# EasyEDA schematic SCH_μAtlas_2026-06-27.json

## Sheets
1 PWR_Management: TITLE: PWR Management; REV: 1.0; Date: 2026-06-20; Sheet: 1/8; Drawn By: httperry; Company: HackClub - Macondo
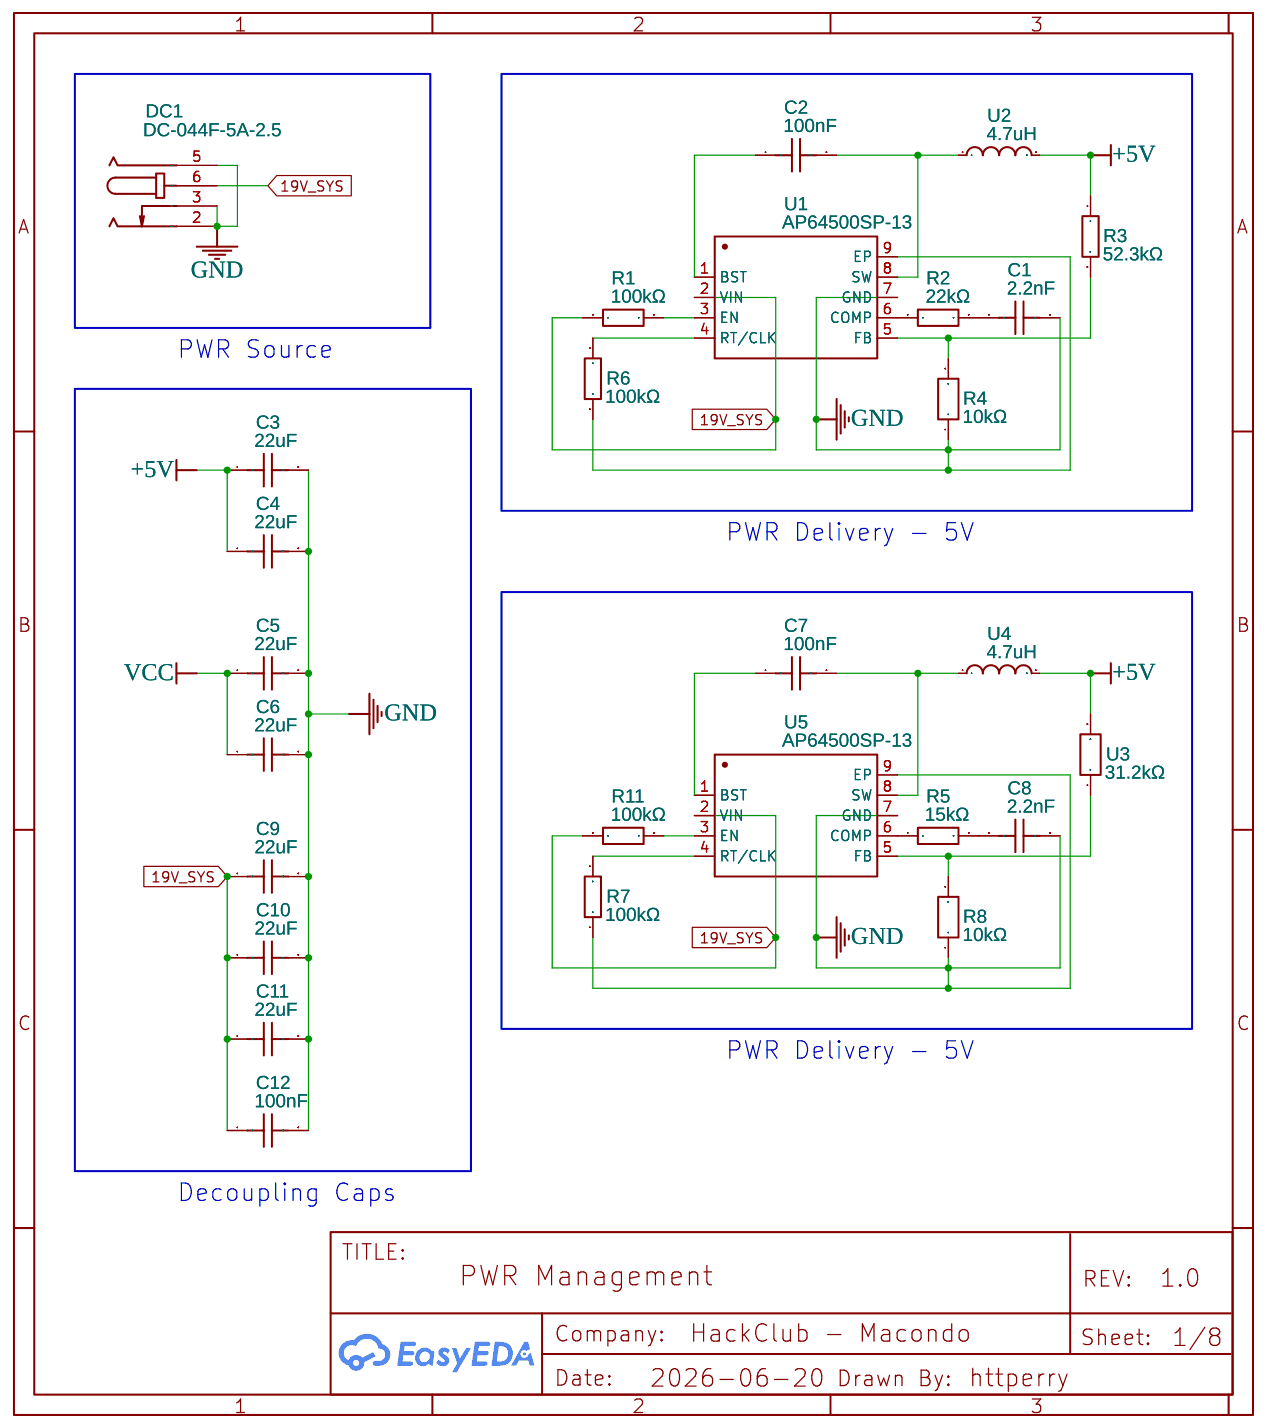
[diagram p0: PWR_Management]
2 SATA_Ports: TITLE: SATA Ports; Date: 2026-06-21; Sheet: 2/8
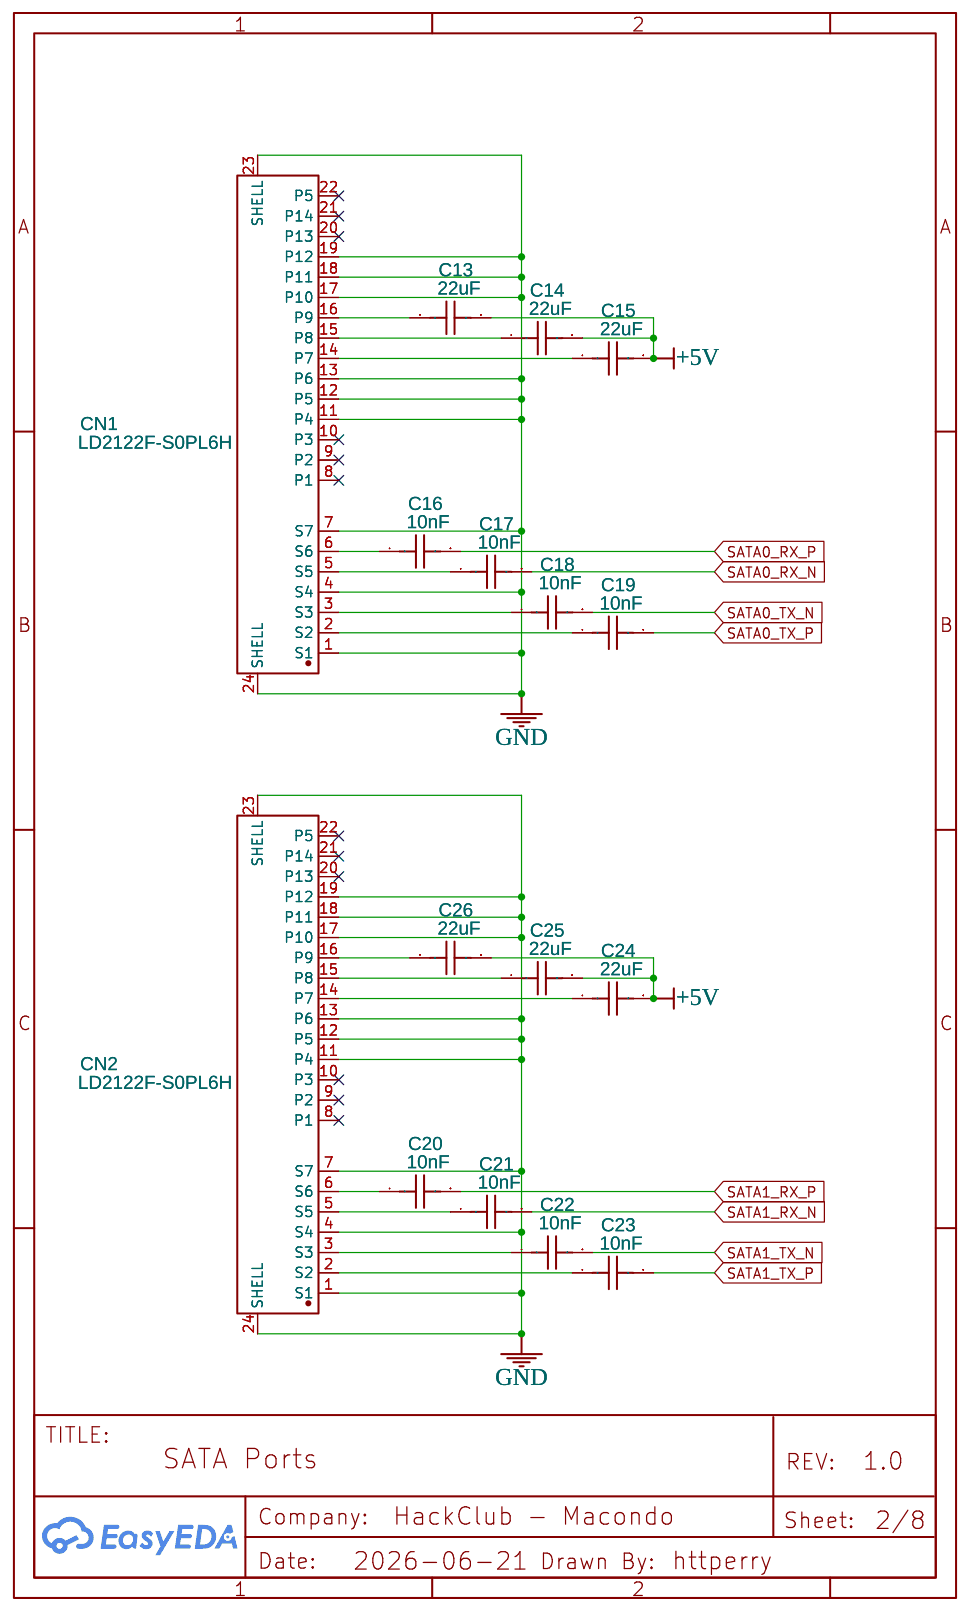
[diagram p1: SATA_Ports]
3 NVMe_(Networking)_Ports: TITLE: NVMe (Networking) Ports; Date: 2026-06-21; Sheet: 3/8; Company: HackClub Macondo
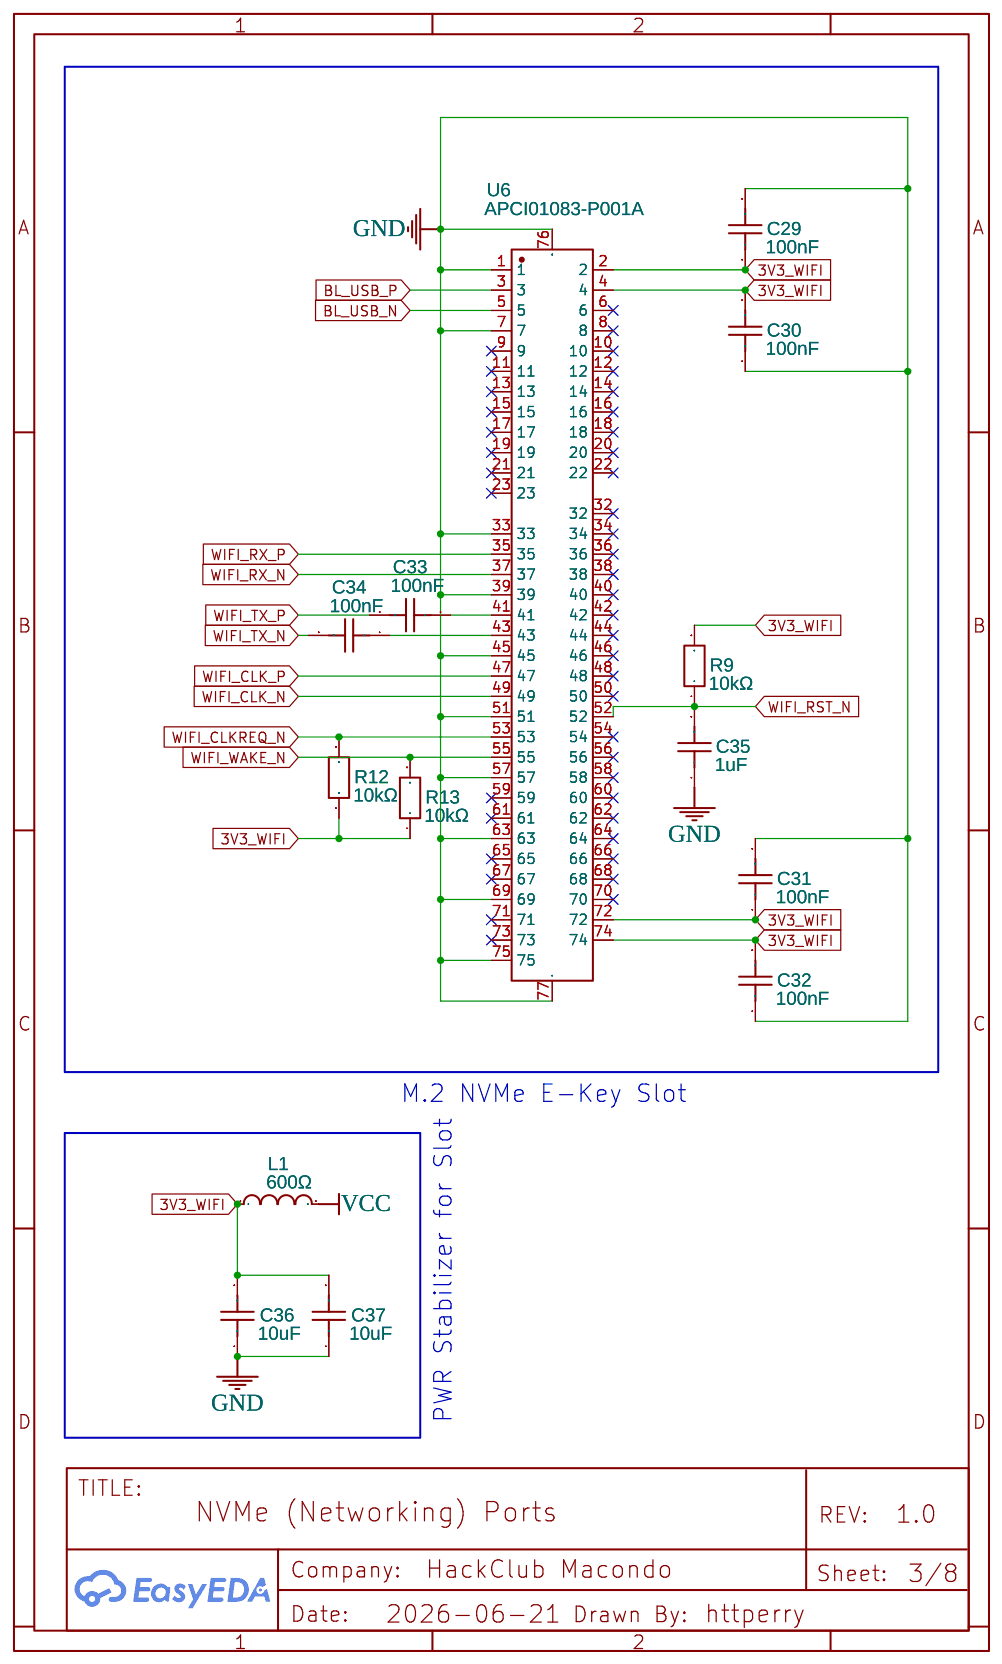
[diagram p2: NVMe_(Networking)_Ports]
4 NVMe_(Storage)_Ports: TITLE: NVMe (Storage) Ports; Date: 2026-06-22; Sheet: 4/8; Company: HackClub Macondo
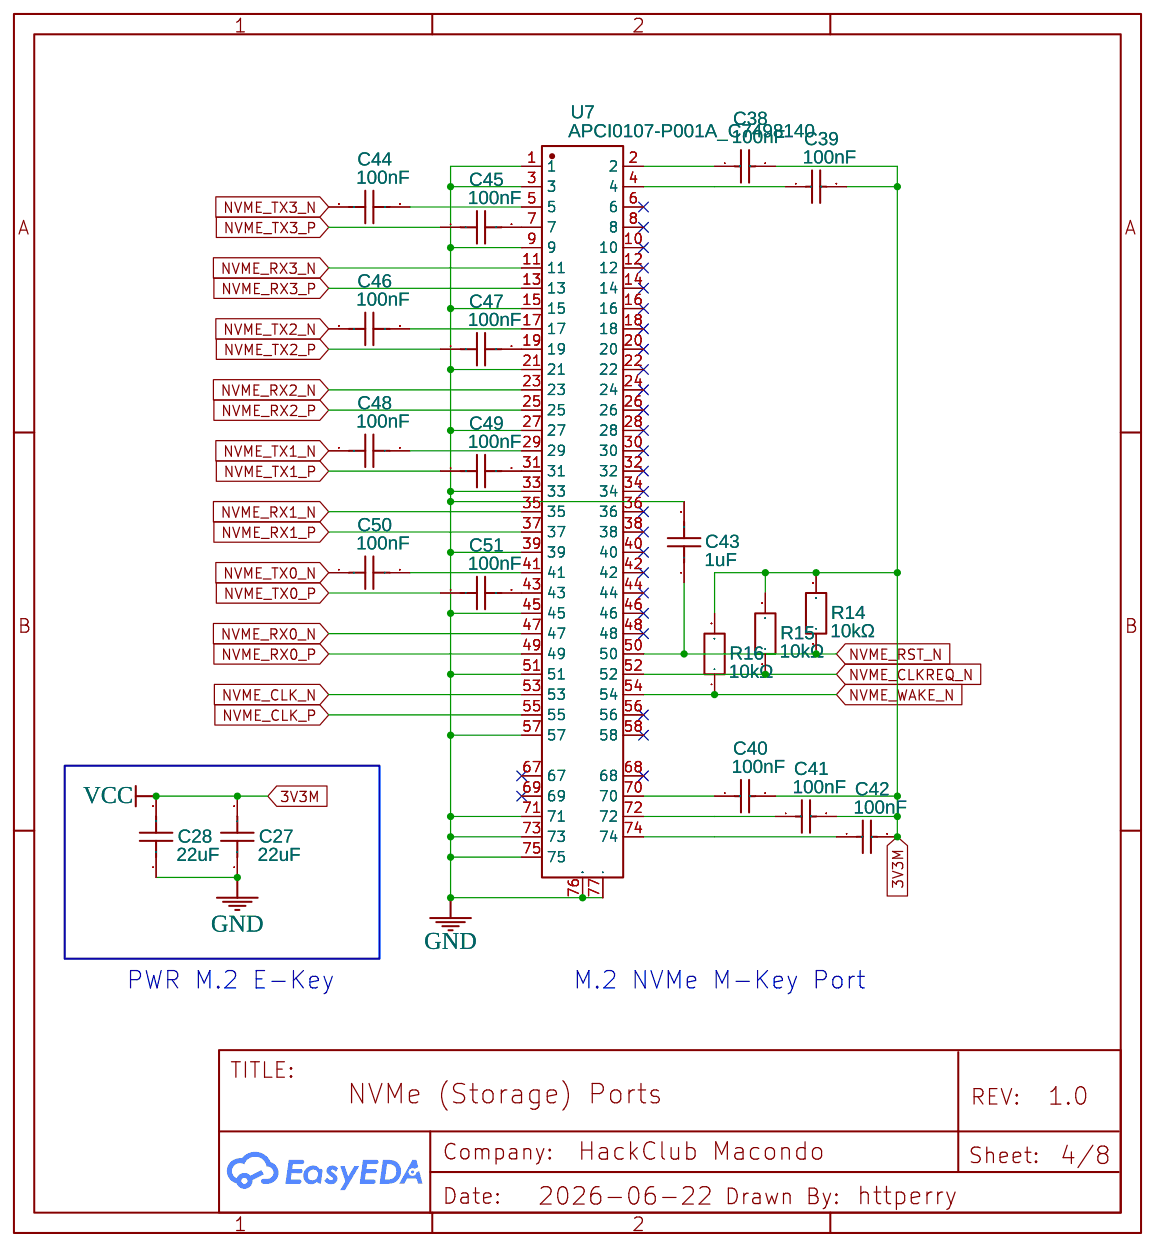
[diagram p3: NVMe_(Storage)_Ports]
5 IO_Ethernet: TITLE: IO_Ethernet; Date: 2026-06-22; Sheet: 5/8; Company: HackClub Macondo
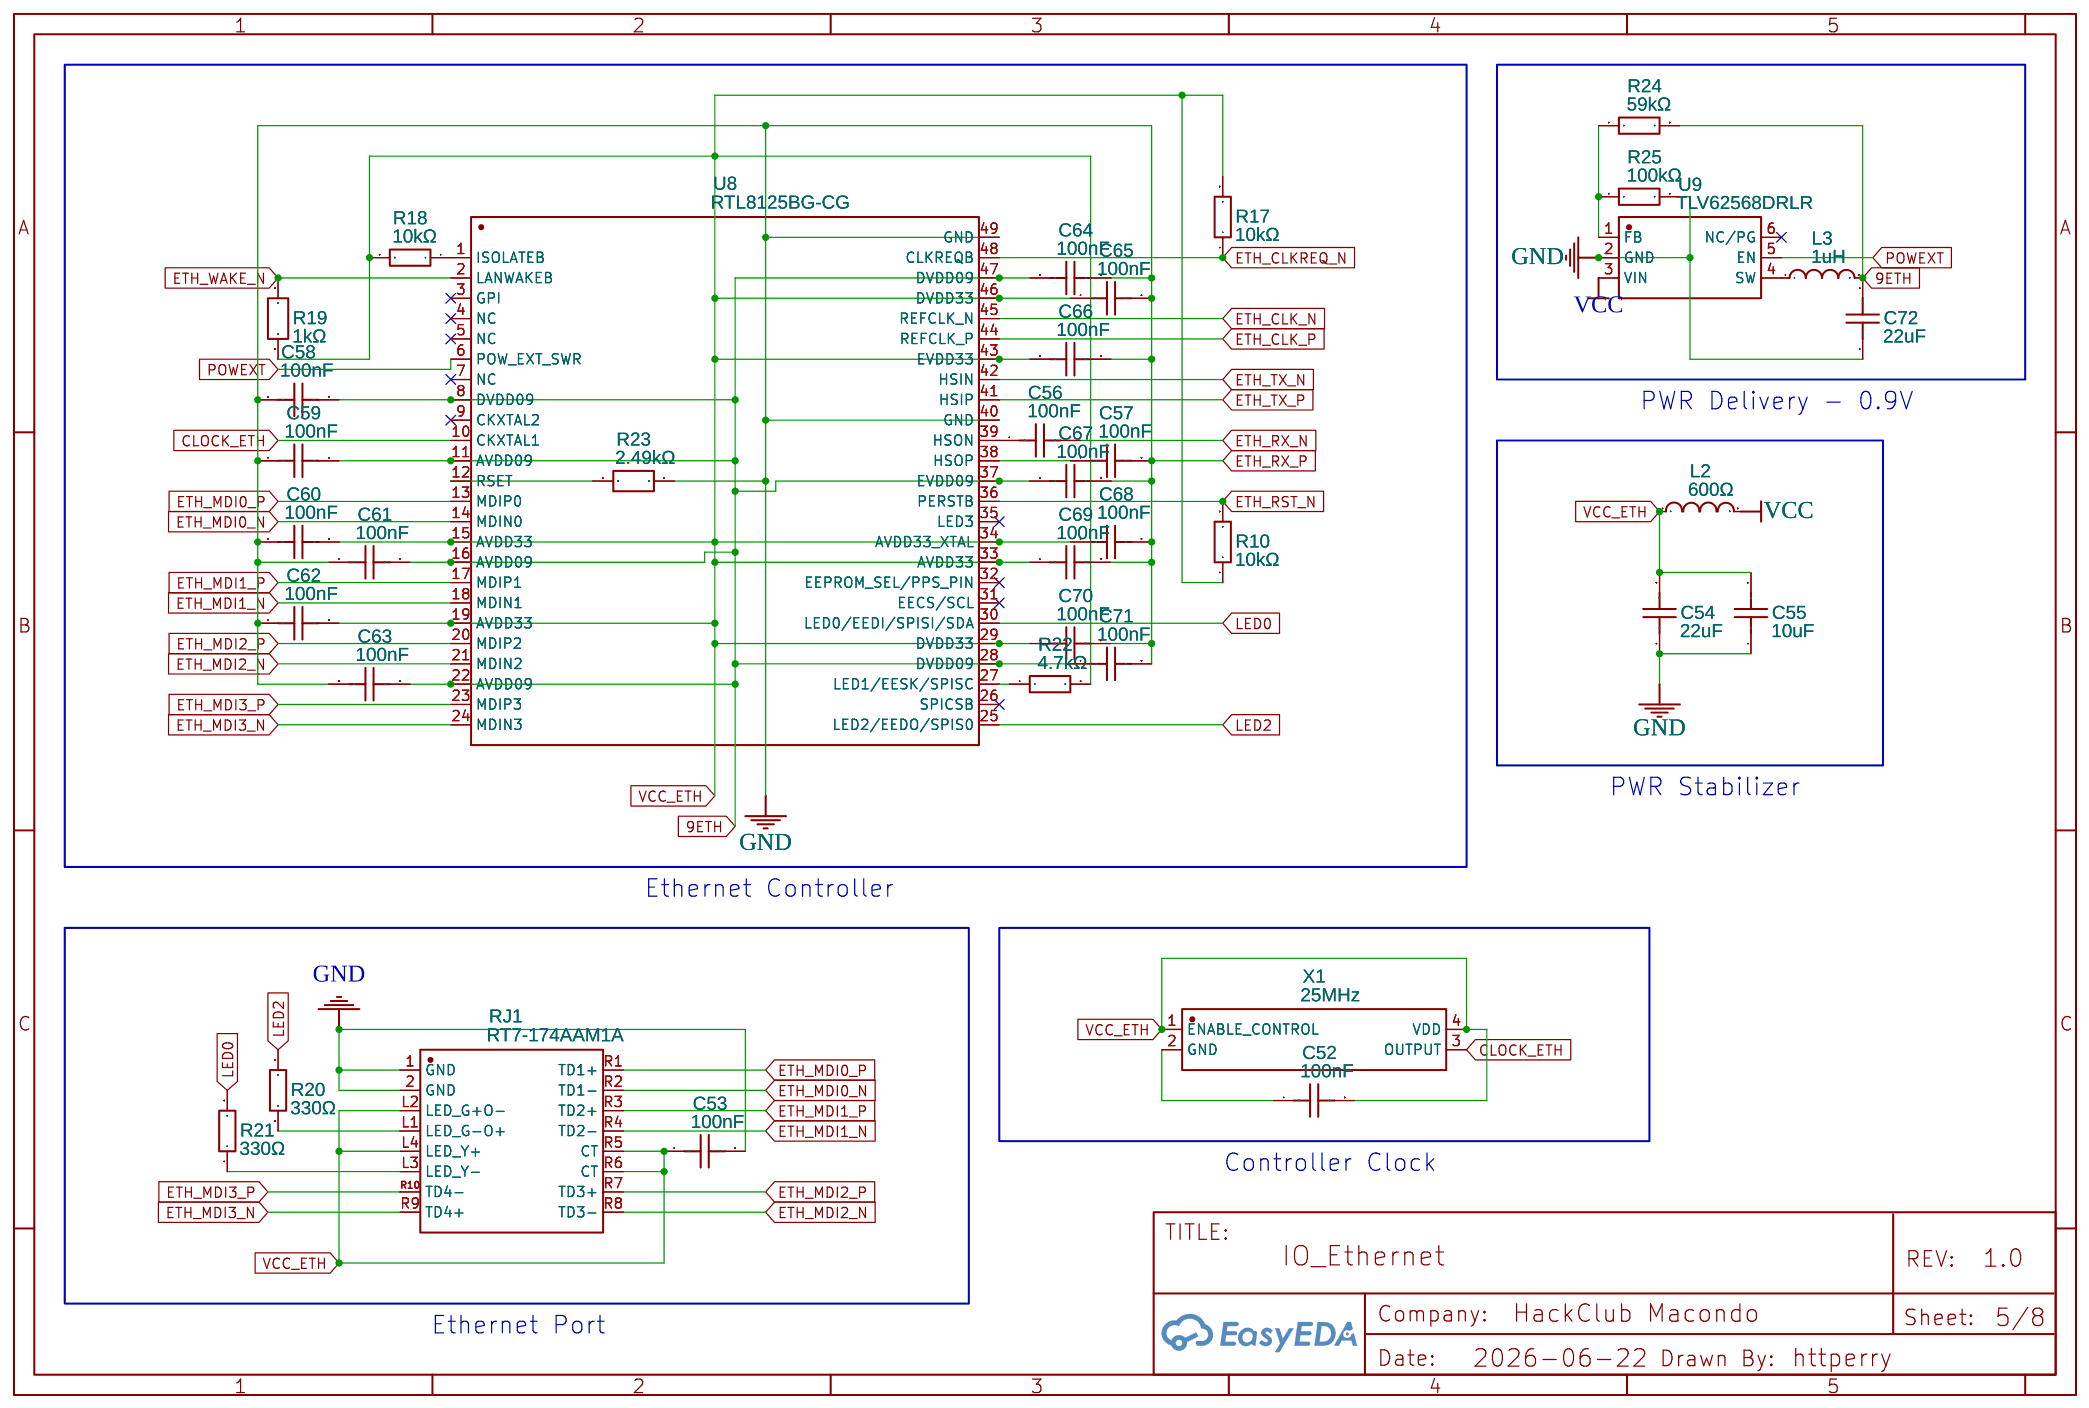
[diagram p4: IO_Ethernet]
6 IO_USB: TITLE: IO_USB; Date: 2026-06-26; Sheet: 6/8
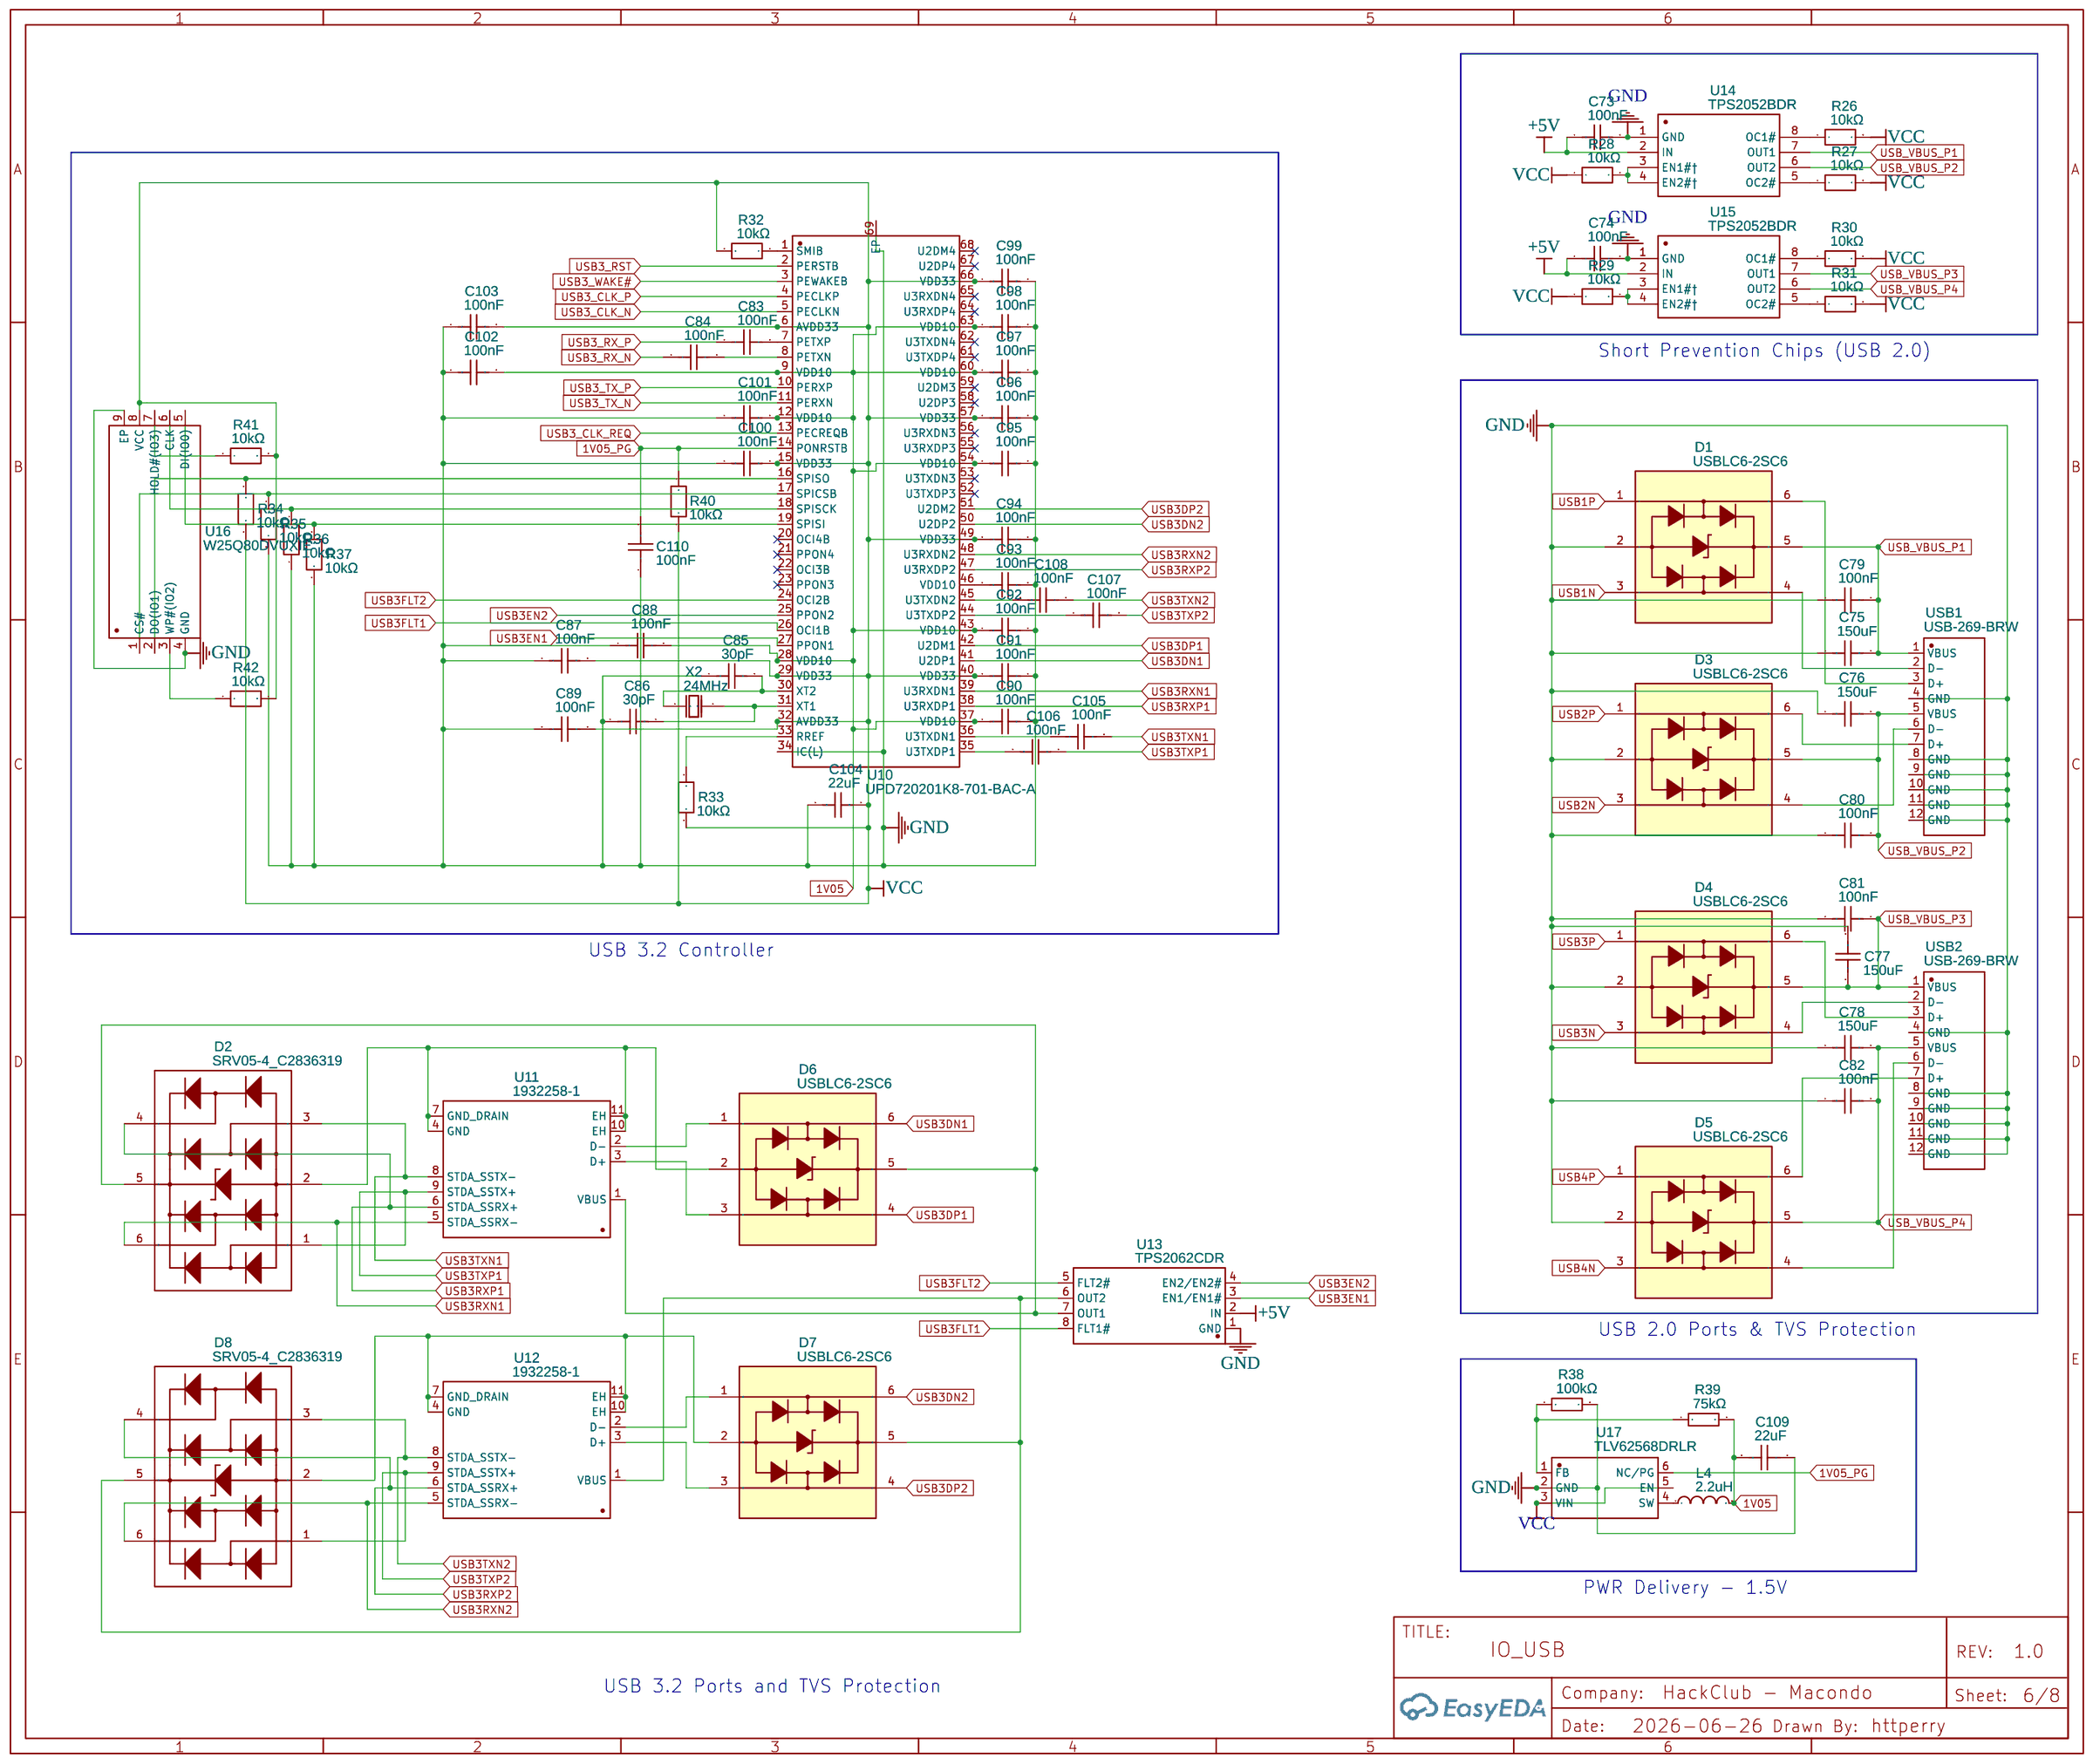
[diagram p5: IO_USB]
7 IO_HDMI: TITLE: IO_HDMI; REV: 1.1; Date: 2026-06-27; Sheet: 7/8
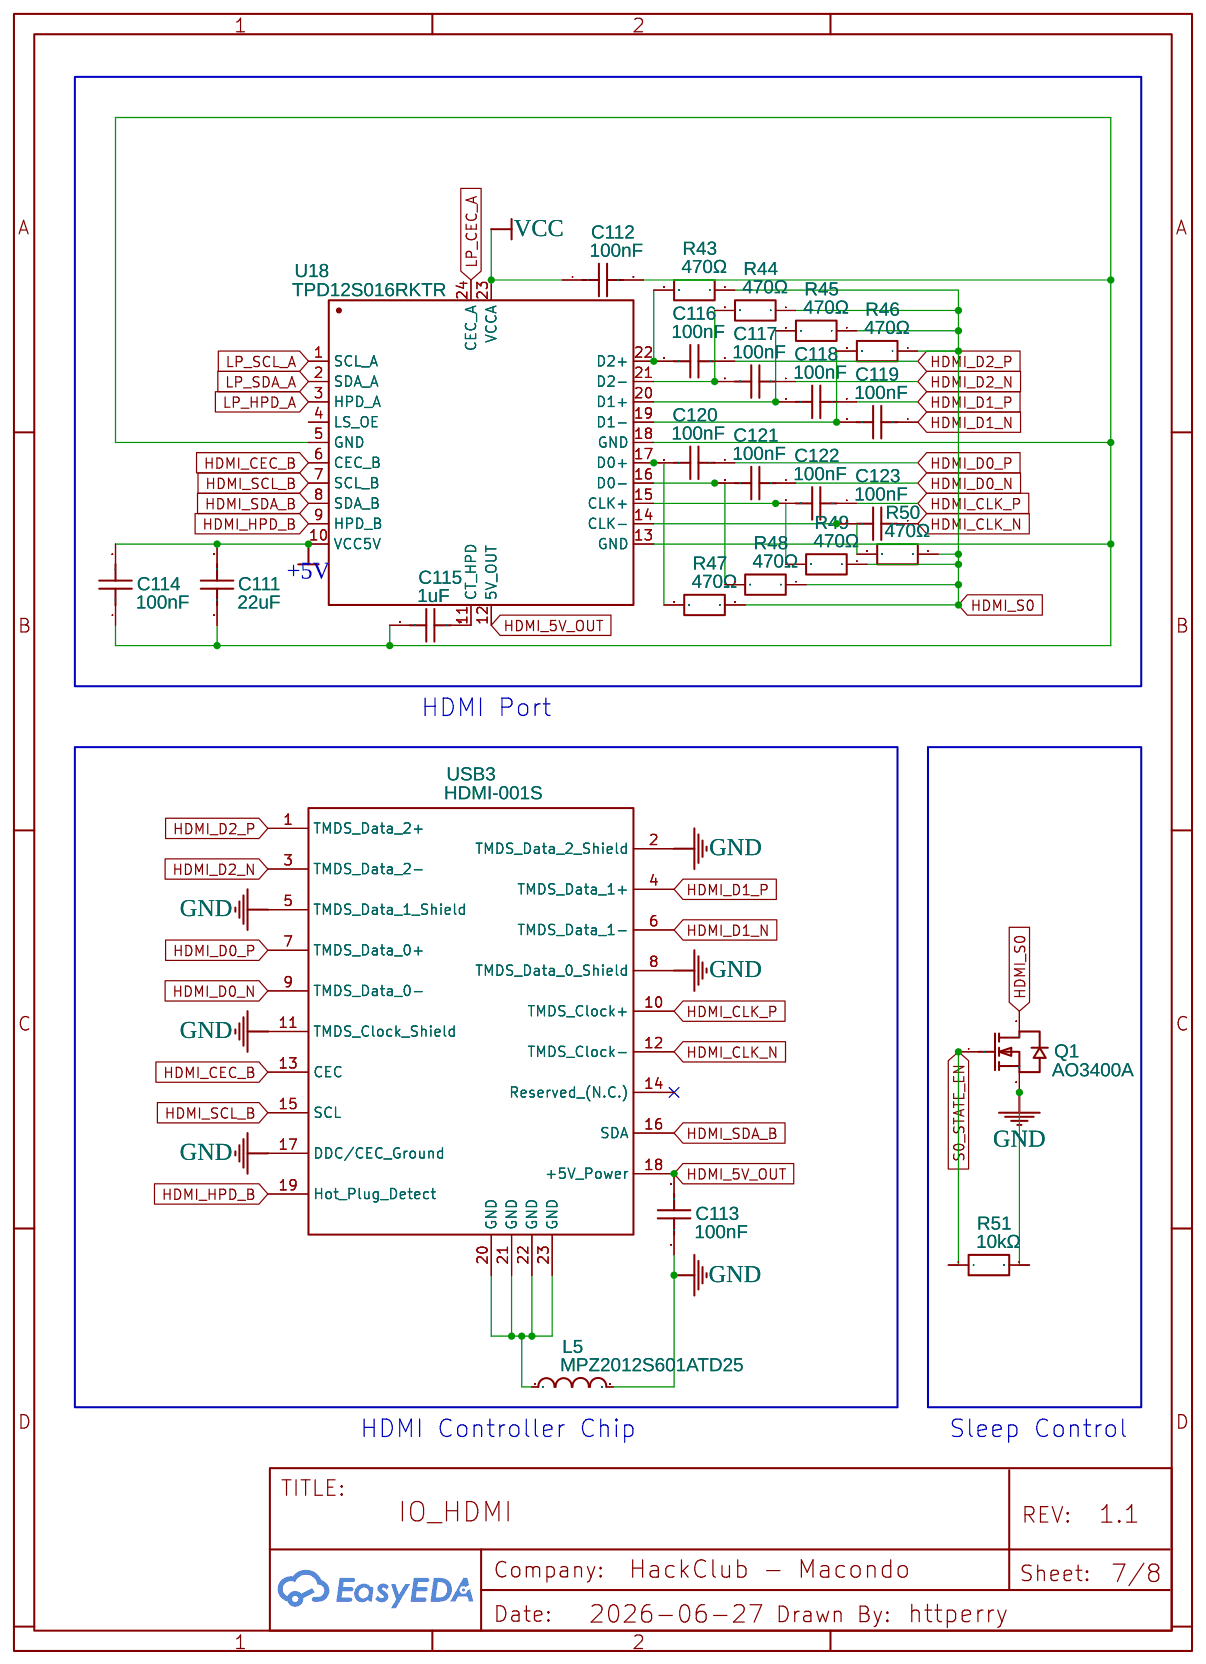
[diagram p6: IO_HDMI]
8 SoM_SODIMM: TITLE: LattePanda Mu (SO-DIMM Connector); Date: 2026-06-27; Sheet: 8/8
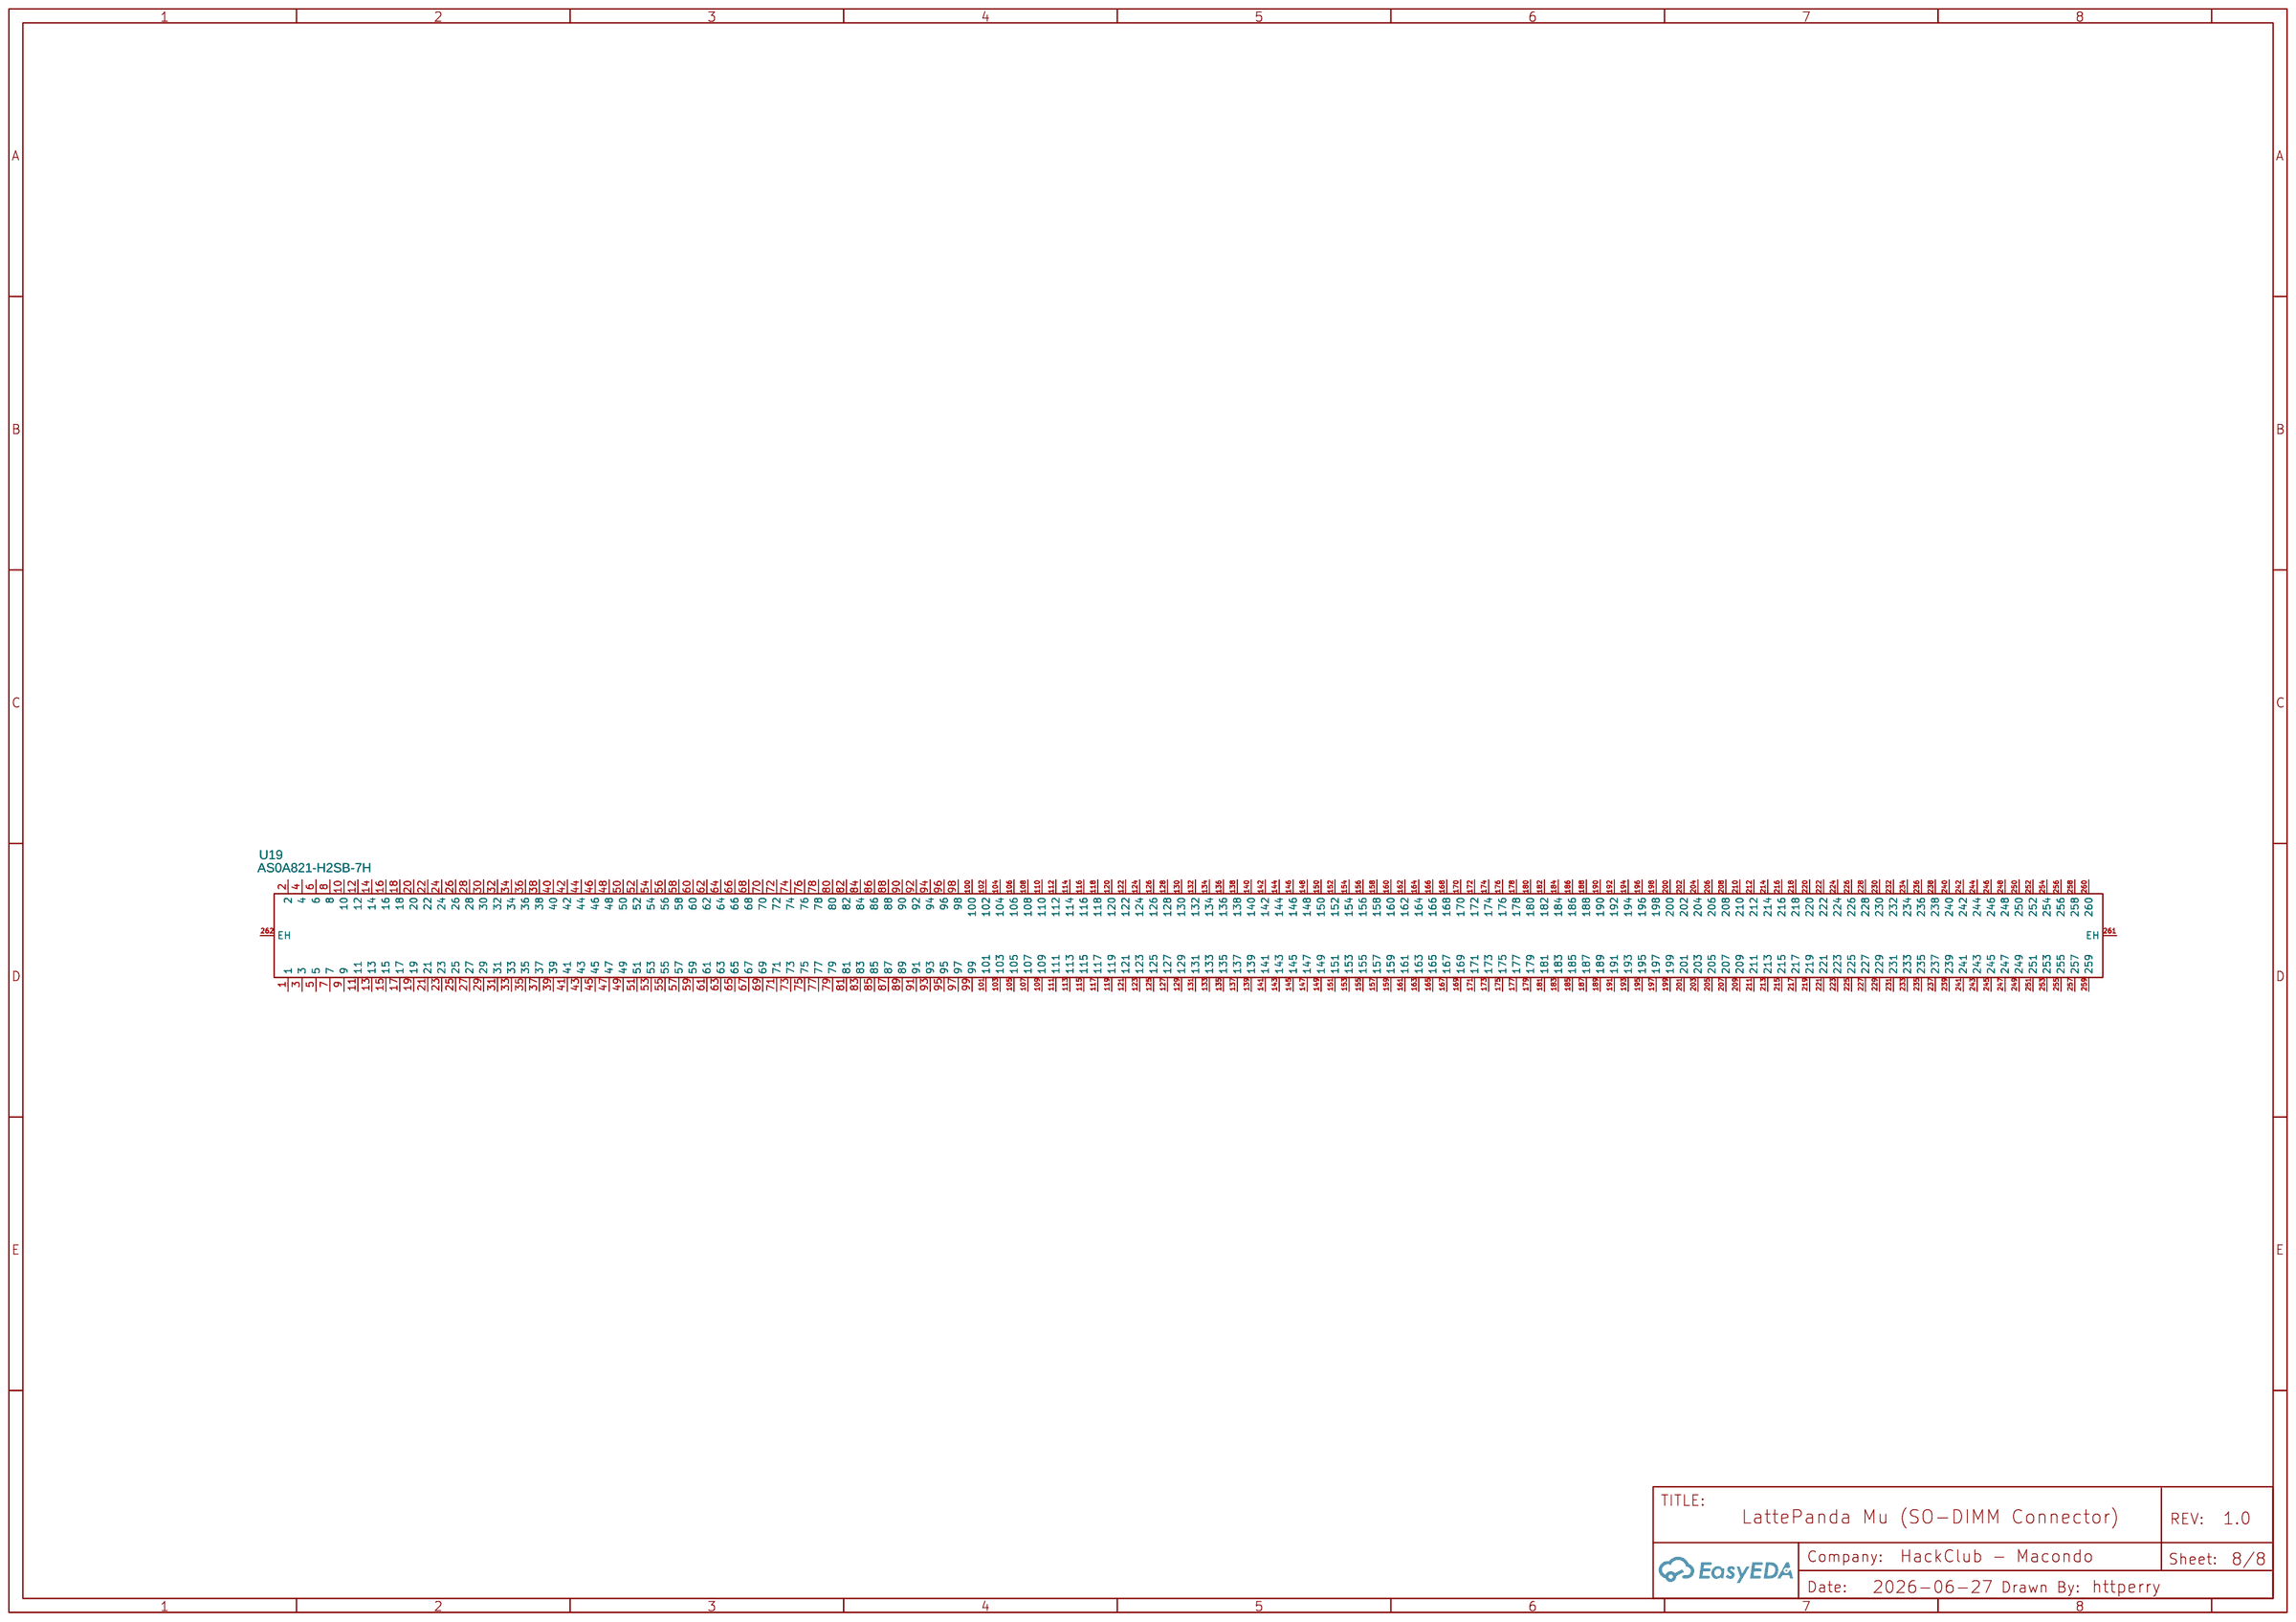
[diagram p7: SoM_SODIMM]

## Parts
sheet IO_Ethernet
C52  100nF  [C0402]
C53  100nF  [C0402]
C54  22uF  [C0805]
C55  10uF  [C0805]
C56  100nF  [C0402]
C57  100nF  [C0402]
C58  100nF  [C0402]
C59  100nF  [C0402]
C60  100nF  [C0402]
C61  100nF  [C0402]
C62  100nF  [C0402]
C63  100nF  [C0402]
C64  100nF  [C0402]
C65  100nF  [C0402]
C66  100nF  [C0402]
C67  100nF  [C0402]
C68  100nF  [C0402]
C69  100nF  [C0402]
C70  100nF  [C0402]
C71  100nF  [C0402]
C72  22uF  [C0805]
L2  600Ω  [L0805]
L3  1uH  [IND-SMD_L2.0-W1.6-B]
R10  10kΩ  [R0402]
R17  10kΩ  [R0402]
R18  10kΩ  [R0402]
R19  1kΩ  [R0402]
R20  330Ω  [R0402]
R21  330Ω  [R0402]
R22  4.7kΩ  [R0402]
R23  2.49kΩ  [R0402]
R24  59kΩ  [R0603]
R25  100kΩ  [R0603]
RJ1  RT7-174AAM1A  [RJ45-TH_RT7-174AAM1A]
U8  RTL8125BG-CG  [TQFN-48_L6.0-W6.0-P0.40-BL-EP4.5]
U9  TLV62568DRLR  [SOT-563_L1.6-W1.2-P0.50-LS1.6-BL]
X1  25MHz  [OSC-SMD_4P-L3.2-W2.5-BL_SG-8018CE]
sheet IO_HDMI
C111  22uF  [C0805]
C112  100nF  [C0402]
C113  100nF  [C0402]
C114  100nF  [C0402]
C115  1uF  [C0402]
C116  100nF  [C0402]
C117  100nF  [C0402]
C118  100nF  [C0402]
C119  100nF  [C0402]
C120  100nF  [C0402]
C121  100nF  [C0402]
C122  100nF  [C0402]
C123  100nF  [C0402]
L5  MPZ2012S601ATD25  [L0805]
Q1  AO3400A  [SOT-23-3_L2.9-W1.3-P1.90-LS2.4-BR]
R43  470Ω  [R0402]
R44  470Ω  [R0402]
R45  470Ω  [R0402]
R46  470Ω  [R0402]
R47  470Ω  [R0402]
R48  470Ω  [R0402]
R49  470Ω  [R0402]
R50  470Ω  [R0402]
R51  10kΩ  [R0402]
U18  TPD12S016RKTR  [UQFN-24_L4.0-W2.0-P0.40-BL]
USB3  HDMI-001S  [HDMI-SMD_HDMI-001S]
sheet IO_USB
C73  100nF  [C0402]
C74  100nF  [C0402]
C75  150uF  [C1206]
C76  150uF  [C1206]
C77  150uF  [C1206]
C78  150uF  [C1206]
C79  100nF  [C0402]
C80  100nF  [C0402]
C81  100nF  [C0402]
C82  100nF  [C0402]
C83  100nF  [C0402]
C84  100nF  [C0402]
C85  30pF  [C0402]
C86  30pF  [C0402]
C87  100nF  [C0402]
C88  100nF  [C0402]
C89  100nF  [C0402]
C90  100nF  [C0402]
C91  100nF  [C0402]
C92  100nF  [C0402]
C93  100nF  [C0402]
C94  100nF  [C0402]
C95  100nF  [C0402]
C96  100nF  [C0402]
C97  100nF  [C0402]
C98  100nF  [C0402]
C99  100nF  [C0402]
C100  100nF  [C0402]
C101  100nF  [C0402]
C102  100nF  [C0402]
C103  100nF  [C0402]
C104  22uF  [C0805]
C105  100nF  [C0402]
C106  100nF  [C0402]
C107  100nF  [C0402]
C108  100nF  [C0402]
C109  22uF  [C0805]
C110  100nF  [C0402]
D1  USBLC6-2SC6  [SOT-23-6_L2.9-W1.6-P0.95-LS2.8-BL]
D2  SRV05-4_C2836319  [SOT-23-6_L2.9-W1.6-P0.95-LS2.8-BL]
D3  USBLC6-2SC6  [SOT-23-6_L2.9-W1.6-P0.95-LS2.8-BL]
D4  USBLC6-2SC6  [SOT-23-6_L2.9-W1.6-P0.95-LS2.8-BL]
D5  USBLC6-2SC6  [SOT-23-6_L2.9-W1.6-P0.95-LS2.8-BL]
D6  USBLC6-2SC6  [SOT-23-6_L2.9-W1.6-P0.95-LS2.8-BL]
D7  USBLC6-2SC6  [SOT-23-6_L2.9-W1.6-P0.95-LS2.8-BL]
D8  SRV05-4_C2836319  [SOT-23-6_L2.9-W1.6-P0.95-LS2.8-BL]
L4  2.2uH  [L0805]
R26  10kΩ  [R0402]
R27  10kΩ  [R0402]
R28  10kΩ  [R0402]
R29  10kΩ  [R0402]
R30  10kΩ  [R0402]
R31  10kΩ  [R0402]
R32  10kΩ  [R0402]
R33  10kΩ  [R0402]
R34  10kΩ  [R0402]
R35  10kΩ  [R0402]
R36  10kΩ  [R0402]
R37  10kΩ  [R0402]
R38  100kΩ  [R0603]
R39  75kΩ  [R0603]
R40  10kΩ  [R0402]
R41  10kΩ  [R0402]
R42  10kΩ  [R0402]
U10  UPD720201K8-701-BAC-A  [QFN-68_L8.0-W8.0-P0.40-BL-EP6.2]
U11  1932258-1  [USB-A-TH_1932258-1]
U12  1932258-1  [USB-A-TH_1932258-1]
U13  TPS2062CDR  [SOIC-8_L4.9-W3.9-P1.27-LS6.0-BL]
U14  TPS2052BDR  [SOIC-8_L4.9-W3.9-P1.27-LS6.0-BL]
U15  TPS2052BDR  [SOIC-8_L4.9-W3.9-P1.27-LS6.0-BL]
U16  W25Q80DVUXIE  [USON-8_L3.0-W2.0-P0.50-BL-EP_GD25QXX]
U17  TLV62568DRLR  [SOT-563_L1.6-W1.2-P0.50-LS1.6-BL]
USB1  USB-269-BRW  [USB-A-TH_USB-269-BRW]
USB2  USB-269-BRW  [USB-A-TH_USB-269-BRW]
X2  24MHz  [CRYSTAL-SMD_2P-L6.0-W3.5]
sheet NVMe_(Networking)_Ports
C29  100nF  [C0402]
C30  100nF  [C0402]
C31  100nF  [C0402]
C32  100nF  [C0402]
C33  100nF  [C0402]
C34  100nF  [C0402]
C35  1uF  [C0402]
C36  10uF  [C0805]
C37  10uF  [C0805]
L1  600Ω  [L0805]
R9  10kΩ  [R0402]
R12  10kΩ  [R0402]
R13  10kΩ  [R0402]
U6  APCI01083-P001A  [CONN-SMD_APCI01083-P001A]
sheet NVMe_(Storage)_Ports
C27  22uF  [C0805]
C28  22uF  [C0805]
C38  100nF  [C0402]
C39  100nF  [C0402]
C40  100nF  [C0402]
C41  100nF  [C0402]
C42  100nF  [C0402]
C43  1uF  [C0402]
C44  100nF  [C0402]
C45  100nF  [C0402]
C46  100nF  [C0402]
C47  100nF  [C0402]
C48  100nF  [C0402]
C49  100nF  [C0402]
C50  100nF  [C0402]
C51  100nF  [C0402]
R14  10kΩ  [R0402]
R15  10kΩ  [R0402]
R16  10kΩ  [R0402]
U7  APCI0107-P001A_C7498140  [CONN-SMD_APCI0107-P001A]
sheet PWR_Management
C1  2.2nF  [C0603]
C2  100nF  [C0603]
C3  22uF  [C0603]
C4  22uF  [C0603]
C5  22uF  [C0603]
C6  22uF  [C0603]
C7  100nF  [C0603]
C8  2.2nF  [C0603]
C9  22uF  [CAP-SMD_L6.1-W5.3-L]
C10  22uF  [CAP-SMD_L6.1-W5.3-L]
C11  22uF  [CAP-SMD_L6.1-W5.3-L]
C12  100nF  [C0603]
DC1  DC-044F-5A-2.5  [DC-IN-TH_DC-044F-5A-2.5]
R1  100kΩ  [R0603]
R2  22kΩ  [R0603]
R3  52.3kΩ  [R0603]
R4  10kΩ  [R0603]
R5  15kΩ  [R0603]
R6  100kΩ  [R0603]
R7  100kΩ  [R0603]
R8  10kΩ  [R0603]
R11  100kΩ  [R0603]
U1  AP64500SP-13  [SO-8_L4.9-W3.9-P1.27-LS6.0-BL-EP]
U2  4.7uH  [IND-SMD_L7.0-W6.6_APH0630]
U3  31.2kΩ  [R0603]
U4  4.7uH  [IND-SMD_L7.0-W6.6_APH0630]
U5  AP64500SP-13  [SO-8_L4.9-W3.9-P1.27-LS6.0-BL-EP]
sheet SATA_Ports
C13  22uF  [C0603]
C14  22uF  [C0603]
C15  22uF  [C0603]
C16  10nF  [C0402]
C17  10nF  [C0402]
C18  10nF  [C0402]
C19  10nF  [C0402]
C20  10nF  [C0402]
C21  10nF  [C0402]
C22  10nF  [C0402]
C23  10nF  [C0402]
C24  22uF  [C0603]
C25  22uF  [C0603]
C26  22uF  [C0603]
CN1  LD2122F-S0PL6H  [CONN-SMD_LD2122F-S0PL6H]
CN2  LD2122F-S0PL6H  [CONN-SMD_LD2122F-S0PL6H]
sheet SoM_SODIMM
U19  AS0A821-H2SB-7H  [CONN-SMD_AS0A821-H2SB-7H]

## Library data of the parts
C44-C47 C52 C53 C56-C71 C73 C74 C79-C84 C87-C103 C105-C108 C110 C112-C114 C116-C123 = GRM155R71H104KE14J: Contributor: lcsc; Supplier: LCSC; Supplier Part: C2649519; Manufacturer: muRata(村田); JLCPCB Part Class: Extended Part
C54 C72 C104 C109 C111 = GRT21BR61E226ME13L: Contributor: LCSC; Supplier: LCSC; Supplier Part: C398931; Manufacturer: muRata(村田); JLCPCB Part Class: Extended Part
C55 = TCC0805X5R106K250FT: Supplier: LCSC; Supplier Part: C5448891; Manufacturer: CCTC(三环); JLCPCB Part Class: Extended Part; Contributor: lcsc
L1 L2 = MPZ2012S601AT000: Supplier: LCSC; Manufacturer: TDK; Supplier Part: C21519; JLCPCB Part Class: Extended Part
L3 = XRIM201612S1R0MBCA: Supplier: LCSC; Supplier Part: C22471099; Manufacturer: XR(祥如); JLCPCB Part Class: Extended Part; Contributor: lcsc
R10 R17 R18 = ERA2AEB103X: Contributor: LCSC; Supplier: LCSC; Supplier Part: C191915; Manufacturer: PANASONIC(松下); JLCPCB Part Class: Extended Part
R19 = RT0402BRD071KL: Contributor: lcsc; Supplier: LCSC; Supplier Part: C852624; Manufacturer: YAGEO(国巨); JLCPCB Part Class: Extended Part
R20 R21 = RC0402JR-07330RL: Contributor: LCSC; Supplier: LCSC; Manufacturer: YAGEO(国巨); Supplier Part: C105876; JLCPCB Part Class: Extended Part
R22 = RC0402FR-074K7L: Supplier: LCSC; Manufacturer: YAGEO(国巨); Supplier Part: C105871; JLCPCB Part Class: Extended Part
R23 = FRC0402F2491TS: Supplier: LCSC; Supplier Part: C2933083; Manufacturer: FOJAN(富捷); Contributor: lcsc; JLCPCB Part Class: Extended Part
R24 = RS-03K5902FT: Contributor: LCSC; Supplier: LCSC; Supplier Part: C321955; Manufacturer: FH(风华); JLCPCB Part Class: Extended Part
R1 R6 R7 R11 R25 R38 = RS-03K1003FT_C115320: Contributor: LCSC; Supplier: LCSC; Manufacturer: FH(风华); Manufacturer Part: RS-03K1003FT; Supplier Part: C115320; JLCPCB Part Class: Extended Part
RJ1 = RT7-174AAM1A: Contributor: LCSC; Supplier: LCSC; Supplier Part: C711505; Manufacturer: UDE(涌德电子); JLCPCB Part Class: Extended Part
U8 = RTL8125BG-CG: Contributor: lcsc; Supplier: LCSC; Supplier Part: C3013605; Manufacturer: REALTEK(瑞昱); JLCPCB Part Class: Extended Part
U9 U17 = TLV62568DRLR: Contributor: LCSC; Supplier: LCSC; Supplier Part: C398370; Manufacturer: TI(德州仪器); JLCPCB Part Class: Extended Part
X1 = SX3M25.000B10G40TNN: Supplier: LCSC; Supplier Part: C5452698; Manufacturer: SCTF(星通时频); JLCPCB Part Class: Extended Part; Contributor: lcsc
C115 = MSASU105CB5105KFNA01: Supplier: LCSC; Supplier Part: C7001784; Manufacturer: TAIYO YUDEN(太诱); JLCPCB Part Class: Extended Part; Contributor: lcsc
L5 = MPZ2012S601ATD25: Contributor: LCSC; Supplier: LCSC; Supplier Part: C81034; Manufacturer: TDK; JLCPCB Part Class: Extended Part
Q1 = AO3400A: Supplier: LCSC; Manufacturer: AOS; Supplier Part: C20917; JLCPCB Part Class: Basic Part
R43-R50 = FRC0402F4700TS: Supplier: LCSC; Supplier Part: C2909361; Manufacturer: FOJAN(富捷); JLCPCB Part Class: Extended Part; Contributor: lcsc
R9 R14-R16 R26-R37 R40-R42 R51 = FRC0402F1002TS: Contributor: LCSC; Supplier: LCSC; Supplier Part: C2906861; Manufacturer: FOJAN(富捷); JLCPCB Part Class: Extended Part
U18 = TPD12S016RKTR: Contributor: LCSC; Supplier: LCSC; Supplier Part: C165140; Manufacturer: TI(德州仪器); JLCPCB Part Class: Extended Part
USB3 = HDMI-001S: Contributor: LCSC; Supplier: LCSC; Supplier Part: C720616; Manufacturer: XUNPU(讯普); JLCPCB Part Class: Extended Part
C75-C78 = GRM31CR60J157ME11L: Contributor: LCSC; Supplier: LCSC; Supplier Part: C528968; Manufacturer: muRata(村田); JLCPCB Part Class: Extended Part
C85 C86 = TCC0402COG300J500AT: Contributor: LCSC; Supplier: LCSC; Supplier Part: C696851; Manufacturer: CCTC(三环); JLCPCB Part Class: Extended Part
D1 D3-D7 = USBLC6-2SC6: Supplier: LCSC; Manufacturer: ST(意法半导体); Supplier Part: C7519; JLCPCB Part Class: Extended Part
D2 D8 = SRV05-4_C2836319: Contributor: lcsc; Supplier: LCSC; Supplier Part: C2836319; Manufacturer: MSKSEMI(美森科); Manufacturer Part: SRV05-4; JLCPCB Part Class: Extended Part
L4 = MLP2012H2R2MT0S1: Contributor: LCSC; Supplier: LCSC; Supplier Part: C383369; Manufacturer: TDK; JLCPCB Part Class: Extended Part
R39 = RS-03K7502FT: Contributor: LCSC; Supplier: LCSC; Manufacturer: FH(风华); Supplier Part: C140071; JLCPCB Part Class: Extended Part
U10 = UPD720201K8-701-BAC-A: Contributor: LCSC; Supplier: LCSC; Supplier Part: C355375; Manufacturer: RENESAS(瑞萨)/IDT; JLCPCB Part Class: Extended Part
U11 U12 = 1932258-1: Supplier: LCSC; Supplier Part: C5118692; Manufacturer: TE Connectivity(泰科电子); JLCPCB Part Class: Extended Part; Contributor: lcsc
U13 = TPS2062CDR: Contributor: LCSC; Supplier: LCSC; Supplier Part: C2149911; Manufacturer: TI(德州仪器); JLCPCB Part Class: Extended Part
U14 U15 = TPS2052BDR: Contributor: LCSC; Supplier: LCSC; Manufacturer: TI(德州仪器); Supplier Part: C130049; JLCPCB Part Class: Extended Part
U16 = W25Q80DVUXIE: Contributor: LCSC; Supplier: LCSC; Supplier Part: C401667; Manufacturer: Winbond(华邦); JLCPCB Part Class: Extended Part
USB1 USB2 = USB-269-BRW: Contributor: LCSC; Supplier: LCSC; Supplier Part: C720548; Manufacturer: XUNPU(讯普); JLCPCB Part Class: Extended Part
X2 = ABM7-24.000MHZ-D2Y-T: Contributor: LCSC; Supplier: LCSC; Supplier Part: C179634; Manufacturer: ABRACON; JLCPCB Part Class: Extended Part
C29-C34 = CC0402KRX5R6BB104: Contributor: LCSC; Supplier: LCSC; Supplier Part: C129131; Manufacturer: YAGEO(国巨); JLCPCB Part Class: Extended Part
C35 = TCC0402X5R105K160AT: Contributor: lcsc; Supplier: LCSC; Supplier Part: C5142580; Manufacturer: CCTC(三环); JLCPCB Part Class: Extended Part
C36 C37 = CGA0805X5R106K500MT: Supplier: LCSC; Supplier Part: C6119889; Manufacturer: HRE(芯声); JLCPCB Part Class: Extended Part; Contributor: lcsc
R12 R13 = FRC0402F1002TS: Contributor: LCSC; Supplier: LCSC; Supplier Part: C2906861; Manufacturer: FOJAN(富捷); JLCPCB Part Class: Extended Part; link: https://lcsc.com/eda_search?q=C2906861&%26type=1&ref=editor
U6 = APCI01083-P001A: Supplier: LCSC; Supplier Part: C41425435; Manufacturer: LX(连欣科技); JLCPCB Part Class: Extended Part; Contributor: lcsc
C27 C28 = CL21A226MAYNNNE: Contributor: LCSC; Supplier: LCSC; Supplier Part: C602037; Manufacturer: SAMSUNG(三星); JLCPCB Part Class: Extended Part
C38-C42 = CC0402KRX5R8BB104: Supplier: LCSC; Manufacturer: YAGEO(国巨); Supplier Part: C106256; JLCPCB Part Class: Extended Part
C43 = HGC0402R5105K500NTEJ: Supplier: LCSC; Supplier Part: C7472948; Manufacturer: Chinocera(华瓷); Contributor: lcsc; JLCPCB Part Class: Extended Part
C48-C51 = GRM155R71H104KE14J: Contributor: lcsc; Supplier: LCSC; Supplier Part: C2649519; Manufacturer: muRata(村田); JLCPCB Part Class: Extended Part; link: https://lcsc.com/eda_search?q=C2649519&%26type=1&ref=editor
U7 = APCI0107-P001A_C7498140: Supplier: LCSC; Supplier Part: C7498140; Manufacturer: LX(连欣科技); Manufacturer Part: APCI0107-P001A; JLCPCB Part Class: Extended Part; Contributor: lcsc
C1 C8 = FCC0603B222K500CT: Supplier: LCSC; Supplier Part: C5137562; Manufacturer: FOJAN(富捷); Contributor: lcsc; JLCPCB Part Class: Extended Part
C2 C7 C12 = GRM188R71H104KA93D: Supplier: LCSC; Manufacturer: muRata(村田); Supplier Part: C77055; JLCPCB Part Class: Extended Part
C3-C6 C13-C15 C24-C26 = HGC0603R5226M160NTHJ: Supplier: LCSC; Supplier Part: C22367828; Manufacturer: Chinocera(华瓷); JLCPCB Part Class: Extended Part; Contributor: lcsc
C9-C11 = KCM55QR71H226KH13K: Supplier: LCSC; Supplier Part: C6579204; Manufacturer: muRata(村田); JLCPCB Part Class: Extended Part; Contributor: lcsc
DC1 = DC-044F-5A-2.5: Supplier: LCSC; Supplier Part: C779941; Manufacturer: XKB Connection(中国星坤); JLCPCB Part Class: Extended Part; Contributor: lcsc
R2 = RS-03K2202FT: Contributor: LCSC; Supplier: LCSC; Supplier Part: C286577; Manufacturer: FH(风华); JLCPCB Part Class: Extended Part
R3 = RS-03K5232FT: Contributor: LCSC; Supplier: LCSC; Supplier Part: C304764; Manufacturer: FH(风华); JLCPCB Part Class: Extended Part
R4 R8 = AR03BTS1002: Supplier: LCSC; Supplier Part: C20607729; Manufacturer: Viking(光颉); JLCPCB Part Class: Extended Part; Contributor: lcsc
R5 = CR0603FA1502G: Supplier: LCSC; Manufacturer: LIZ(丽智电子); Supplier Part: C100780; JLCPCB Part Class: Extended Part
U1 U5 = AP64500SP-13: Contributor: LCSC; Supplier: LCSC; Supplier Part: C2070920; Manufacturer: DIODES(美台); JLCPCB Part Class: Extended Part
U2 U4 = APH0630T4R7M: Supplier: LCSC; Supplier Part: C5349705; Manufacturer: APV(爱普微); JLCPCB Part Class: Extended Part; Contributor: lcsc
U3 = RT0603DRE0731K2L: Supplier: LCSC; Supplier Part: C863036; Manufacturer: YAGEO(国巨); JLCPCB Part Class: Extended Part; Contributor: lcsc
C16-C23 = FCC0402B103K500AT: Supplier: LCSC; Supplier Part: C5137480; Manufacturer: FOJAN(富捷); JLCPCB Part Class: Extended Part; Contributor: lcsc; link: https://lcsc.com/eda_search?q=C5137480&%26type=1&ref=editor
CN1 CN2 = LD2122F-S0PL6H: Contributor: LCSC; Supplier: LCSC; Supplier Part: C2761452; Manufacturer: FOXCONN(富士康); JLCPCB Part Class: Extended Part
U19 = AS0A821-H2SB-7H: Contributor: LCSC; Supplier: LCSC; Supplier Part: C2832345; Manufacturer: FOXCONN(富士康); JLCPCB Part Class: Extended Part

## Nets
1V05: C88.2 C90.1 C92.1 C95.1 C97.1 C98.1 C101.2 C102.2 C109.1 L4.2 R39.2 U10.9(VDD10) U10.12(VDD10) U10.28(VDD10) U10.37(VDD10) U10.43(VDD10) U10.54(VDD10) U10.60(VDD10) U10.63(VDD10)
1V05_PG: C110.2 R40.1 U10.14(PONRSTB) U17.6(NC/PG)
3V3_WIFI: C29.1 C30.2 C31.1 C32.2 C36.2 C37.2 L1.1 R9.2 R12.1 R13.1 U6.2 U6.4 U6.72 U6.74
3V3M: C5.1 C6.1 C27.2 C28.2 C38.2 C39.2 C40.2 C41.2 C42.2 C87.2 C89.2 C91.1 C94.1 C96.1 C99.1 C100.2 C103.2 C104.2 C112.1 L1.2 L2.2 R14.2 R15.2 R16.2 R26.2 R27.2 R28.1 R29.1 R30.2 R31.2 R32.2 R33.2 R34.2 R40.2 R41.2 R42.2 U9.3(VIN) U10.6(AVDD33) U10.15(VDD33) U10.29(VDD33) U10.32(AVDD33) U10.40(VDD33) U10.49(VDD33) U10.57(VDD33) U10.66(VDD33) U16.8(VCC) U17.3(VIN) U17.5(EN) U18.23(VCCA)
19V_SYS: C9.1 C10.1 C11.1 C12.1 DC1.6 R1.1 R11.1 U1.2(VIN) U5.2(VIN)
+5V: C3.1 C4.1 C13.2 C14.2 C15.2 C24.2 C25.2 C26.2 C73.1 C74.1 C111.2 C114.2 R3.1 U2.2 U3.2 U4.2 U13.2(IN) U14.2(IN) U15.2(IN) U18.10(VCC5V)
VCC_ETH: C52.2 C53.1 C54.2 C55.2 C60.2 C62.2 C65.1 C66.1 C68.1 C69.1 C70.1 L2.1 R10.1 R17.2 R18.2 R19.1 R22.2 RJ1.L2(LED_G+O-) RJ1.L4(LED_Y+) RJ1.R5(CT) RJ1.R6(CT) U8.15(AVDD33) U8.19(AVDD33) U8.29(DVDD33) U8.33(AVDD33) U8.34(AVDD33_XTAL) U8.43(EVDD33) U8.46(DVDD33) X1.1(ENABLE CONTROL) X1.4(VDD)
9ETH: C58.1 C59.2 C61.2 C63.2 C64.1 C67.1 C71.1 C72.2 L3.2 R24.2 U8.8(DVDD09) U8.11(AVDD09) U8.16(AVDD09) U8.22(AVDD09) U8.28(DVDD09) U8.37(EVDD09) U8.47(DVDD09)
BL_USB_N: U6.5
BL_USB_P: U6.3
CLOCK_ETH: U8.10(CKXTAL1) X1.3(OUTPUT)
ETH_CLK_N: U8.45(REFCLK_N)
ETH_CLK_P: U8.44(REFCLK_P)
ETH_CLKREQ_N: R17.1 U8.48(CLKREQB)
ETH_MDI0_N: RJ1.R2(TD1-) U8.14(MDIN0)
ETH_MDI0_P: RJ1.R1(TD1+) U8.13(MDIP0)
ETH_MDI1_N: RJ1.R4(TD2-) U8.18(MDIN1)
ETH_MDI1_P: RJ1.R3(TD2+) U8.17(MDIP1)
ETH_MDI2_N: RJ1.R8(TD3-) U8.21(MDIN2)
ETH_MDI2_P: RJ1.R7(TD3+) U8.20(MDIP2)
ETH_MDI3_N: RJ1.R9(TD4+) U8.24(MDIN3)
ETH_MDI3_P: RJ1.R10(TD4-) U8.23(MDIP3)
ETH_RST_N: R10.2 U8.36(PERSTB)
ETH_RX_N: C56.2
ETH_RX_P: C1.2 C3.2 C4.2 C5.2 C6.2 C8.2 C9.2 C10.2 C11.2 C12.2 C27.1 C28.1 C29.2 C30.1 C31.2 C32.1 C35.1 C36.1 C37.1 C43.2 C53.2 C54.1 C55.1 C57.2 C58.2 C59.1 C60.1 C61.1 C62.1 C63.1 C64.2 C65.2 C66.2 C67.2 C68.2 C69.2 C70.2 C71.2 C72.1 C73.2 C74.2 C75.1 C76.1 C77.2 C78.1 C79.1 C80.1 C81.1 C82.1 C85.1 C86.1 C87.1 C88.1 C89.1 C90.2 C91.2 C92.2 C93.2 C94.2 C95.2 C96.2 C97.2 C98.2 C99.2 C100.1 C101.1 C102.1 C103.1 C104.1 C109.2 C110.1 C113.1 CN1.1(S1) CN1.4(S4) CN1.7(S7) CN1.11(P4) CN1.12(P5) CN1.13(P6) CN1.17(P10) CN1.18(P11) CN1.19(P12) CN1.23(SHELL) CN1.24(SHELL) CN2.1(S1) CN2.4(S4) CN2.7(S7) CN2.11(P4) CN2.12(P5) CN2.13(P6) CN2.17(P10) CN2.18(P11) CN2.19(P12) CN2.23(SHELL) CN2.24(SHELL) D1.2 D3.2 D4.2 D5.2 DC1.2 DC1.3 DC1.5 L5.2 Q1.2(S) R4.1 R6.1 R7.1 R8.1 R23.1 R25.2 R35.2 R36.2 R37.2 R38.2 R51.2 RJ1.1(GND) RJ1.2(GND) U1.7(GND) U1.9(EP) U5.7(GND) U5.9(EP) U6.1 U6.7 U6.33 U6.39 U6.45 U6.51 U6.57 U6.63 U6.69 U6.75 U6.76 U6.77 U7.1 U7.3 U7.9 U7.15 U7.21 U7.27 U7.33 U7.39 U7.45 U7.51 U7.57 U7.71 U7.73 U7.75 U7.76 U7.77 U8.40(GND) U8.49(GND) U9.2(GND) U10.34(IC(L)) U10.69(EP) U13.1(GND) U14.1(GND) U15.1(GND) U16.4(GND) U16.9(EP) U17.2(GND) USB1.4(GND) USB1.8(GND) USB1.9(GND) USB1.10(GND) USB1.11(GND) USB1.12(GND) USB2.4(GND) USB2.8(GND) USB2.9(GND) USB2.10(GND) USB2.11(GND) USB2.12(GND) USB3.2(TMDS Data 2 Shield) USB3.5(TMDS Data 1 Shield) USB3.8(TMDS Data 0 Shield) USB3.11(TMDS Clock Shield) USB3.17(DDC/CEC Ground)
ETH_TX_N: U8.42(HSIN)
ETH_TX_P: U8.41(HSIP)
ETH_WAKE_N: R19.2 U8.2(LANWAKEB)
HDMI_5V_OUT: C113.2 U18.12(5V_OUT) USB3.18(+5V Power)
HDMI_CEC_B: U18.6(CEC_B) USB3.13(CEC)
HDMI_CLK_N: C123.1 USB3.12(TMDS Clock-)
HDMI_CLK_P: C122.1 USB3.10(TMDS Clock+)
HDMI_D0_N: C121.1 USB3.9(TMDS Data 0-)
HDMI_D0_P: C120.1 USB3.7(TMDS Data 0+)
HDMI_D1_N: C119.1 USB3.6(TMDS Data 1-)
HDMI_D1_P: C118.1 USB3.4(TMDS Data 1+)
HDMI_D2_N: C117.1 USB3.3(TMDS Data 2-)
HDMI_D2_P: C116.1 USB3.1(TMDS Data 2+)
HDMI_HPD_B: U18.9(HPD_B) USB3.19(Hot Plug Detect)
HDMI_S0: Q1.3(D) R43.1 R44.1 R45.1 R46.1 R47.1 R48.1 R49.1 R50.1
HDMI_SCL_B: U18.7(SCL_B) USB3.15(SCL)
HDMI_SDA_B: U18.8(SDA_B) USB3.16(SDA)
LED0: R21.2 U8.30(LED0/EEDI/SPISI/SDA)
LED2: R20.1 U8.25(LED2/EEDO/SPIS0)
LP_CEC_A: U18.24(CEC_A)
LP_HPD_A: U18.3(HPD_A)
LP_SCL_A: U18.1(SCL_A)
LP_SDA_A: U18.2(SDA_A)
NVME_CLK_N: U7.53
NVME_CLK_P: U7.55
NVME_CLKREQ_N: R15.1 U7.52
NVME_RST_N: C43.1 R14.1 U7.50
NVME_RX0_N: U7.47
NVME_RX0_P: U7.49
NVME_RX1_N: U7.35
NVME_RX1_P: U7.37
NVME_RX2_N: U7.23
NVME_RX2_P: U7.25
NVME_RX3_N: U7.11
NVME_RX3_P: U7.13
NVME_TX0_N: C50.1
NVME_TX0_P: C51.1
NVME_TX1_N: C48.1
NVME_TX1_P: C49.1
NVME_TX2_N: C46.1
NVME_TX2_P: C47.1
NVME_TX3_N: C44.1
NVME_TX3_P: C45.1
NVME_WAKE_N: R16.1 U7.54
POWEXT: U8.6(POW_EXT_SWR) U9.5(EN)
S0_STATE_EN: Q1.1(G) R51.1
SATA0_RX_N: C17.2
SATA0_RX_P: C16.2
SATA0_TX_N: C18.2
SATA0_TX_P: C19.2
SATA1_RX_N: C21.2
SATA1_RX_P: C20.2
SATA1_TX_N: C22.2
SATA1_TX_P: C23.2
USB1N: D1.3
USB1P: D1.1
USB2N: D3.3
USB2P: D3.1
USB3_CLK_N: U10.5(PECLKN)
USB3_CLK_P: U10.4(PECLKP)
USB3_CLK_REQ: U10.13(PECREQB)
USB3_RST: U10.2(PERSTB)
USB3_RX_N: C84.1
USB3_RX_P: C83.1
USB3_TX_N: U10.11(PERXN)
USB3_TX_P: U10.10(PERXP)
USB3_WAKE#: U10.3(PEWAKEB)
USB3DN1: D6.6 U10.41(U2DP1)
USB3DN2: D7.6 U10.50(U2DP2)
USB3DP1: D6.4 U10.42(U2DM1)
USB3DP2: D7.4 U10.51(U2DM2)
USB3EN1: U10.27(PPON1) U13.3(EN1/EN1#)
USB3EN2: U10.25(PPON2) U13.4(EN2/EN2#)
USB3FLT1: U10.26(OCI1B) U13.8(FLT1#)
USB3FLT2: U10.24(OCI2B) U13.5(FLT2#)
USB3N: D4.3
USB3P: D4.1
USB3RXN1: D2.6 U10.39(U3RXDN1) U11.5(STDA_SSRX-)
USB3RXN2: D8.6 U10.48(U3RXDN2) U12.5(STDA_SSRX-)
USB3RXP1: D2.4 U10.38(U3RXDP1) U11.6(STDA_SSRX+)
USB3RXP2: D8.4 U10.47(U3RXDP2) U12.6(STDA_SSRX+)
USB3TXN1: C105.2 D2.3 U11.8(STDA_SSTX-)
USB3TXN2: C108.2 D8.3 U12.8(STDA_SSTX-)
USB3TXP1: C106.2 D2.1 U11.9(STDA_SSTX+)
USB3TXP2: C107.2 D8.1 U12.9(STDA_SSTX+)
USB4N: D5.3
USB4P: D5.1
USB_VBUS_P1: C75.2 C79.2 D1.5 U14.7(OUT1) USB1.1(VBUS)
USB_VBUS_P2: C76.2 C80.2 D3.5 U14.6(OUT2) USB1.5(VBUS)
USB_VBUS_P3: C77.1 C81.2 D4.5 U15.7(OUT1) USB2.1(VBUS)
USB_VBUS_P4: C78.2 C82.2 D5.5 U15.6(OUT2) USB2.5(VBUS)
WIFI_CLK_N: U6.49
WIFI_CLK_P: U6.47
WIFI_CLKREQ_N: R12.2 U6.53
WIFI_RST_N: C35.2 R9.1 U6.52
WIFI_RX_N: U6.37
WIFI_RX_P: U6.35
WIFI_TX_N: C34.2
WIFI_TX_P: C33.2
WIFI_WAKE_N: R13.2 U6.55
Net-(C1-1): C1.1 R2.2
Net-(C2-1): C2.1 U1.1(BST)
Net-(C2-2): C2.2 U1.8(SW) U2.1
Net-(C7-1): C7.1 U5.1(BST)
Net-(C7-2): C7.2 U4.1 U5.8(SW)
Net-(C8-1): C8.1 R5.2
Net-(C13-1): C13.1 CN1.16(P9)
Net-(C14-1): C14.1 CN1.15(P8)
Net-(C15-1): C15.1 CN1.14(P7)
Net-(C16-1): C16.1 CN1.6(S6)
Net-(C17-1): C17.1 CN1.5(S5)
Net-(C18-1): C18.1 CN1.3(S3)
Net-(C19-1): C19.1 CN1.2(S2)
Net-(C20-1): C20.1 CN2.6(S6)
Net-(C21-1): C21.1 CN2.5(S5)
Net-(C22-1): C22.1 CN2.3(S3)
Net-(C23-1): C23.1 CN2.2(S2)
Net-(C24-1): C24.1 CN2.14(P7)
Net-(C25-1): C25.1 CN2.15(P8)
Net-(C26-1): C26.1 CN2.16(P9)
Net-(C33-1): C33.1 U6.41
Net-(C34-1): C34.1 U6.43
Net-(C38-1): C38.1 U7.2
Net-(C39-1): C39.1 U7.4
Net-(C40-1): C40.1 U7.70
Net-(C41-1): C41.1 U7.72
Net-(C42-1): C42.1 U7.74
Net-(C44-2): C44.2 U7.5
Net-(C45-2): C45.2 U7.7
Net-(C46-2): C46.2 U7.17
Net-(C47-2): C47.2 U7.19
Net-(C48-2): C48.2 U7.29
Net-(C49-2): C49.2 U7.31
Net-(C50-2): C50.2 U7.41
Net-(C51-2): C51.2 U7.43
Net-(C52-1): C52.1 X1.2(GND)
Net-(C56-1): C56.1 U8.39(HSON)
Net-(C57-1): C57.1 U8.38(HSOP)
Net-(C83-2): C83.2 U10.7(PETXP)
Net-(C84-2): C84.2 U10.8(PETXN)
Net-(C85-2): C85.2 U10.30(XT2) X2.1(OSC1)
Net-(C86-2): C86.2 U10.31(XT1) X2.2(OSC2)
Net-(C93-1): C93.1 U10.46(VDD10)
Net-(C105-1): C105.1 U10.36(U3TXDN1)
Net-(C106-1): C106.1 U10.35(U3TXDP1)
Net-(C107-1): C107.1 U10.44(U3TXDP2)
Net-(C108-1): C108.1 U10.45(U3TXDN2)
Net-(C111-1): C111.1 C112.2 C114.1 C115.2 U18.5(GND) U18.13(GND) U18.18(GND)
Net-(C115-1): C115.1 U18.11(CT_HPD)
Net-(C116-2): C116.2 R43.2 U18.22(D2+)
Net-(C117-2): C117.2 R44.2 U18.21(D2-)
Net-(C118-2): C118.2 R45.2 U18.20(D1+)
Net-(C119-2): C119.2 R46.2 U18.19(D1-)
Net-(C120-2): C120.2 R47.2 U18.17(D0+)
Net-(C121-2): C121.2 R48.2 U18.16(D0-)
Net-(C122-2): C122.2 R49.2 U18.15(CLK+)
Net-(C123-2): C123.2 R50.2 U18.14(CLK-)
Net-(D1-4): D1.4 USB1.2(D-)
Net-(D1-6): D1.6 USB1.3(D+)
Net-(D2-2): D2.2 D6.2 U11.4(GND) U11.7(GND_DRAIN) U11.10(EH) U11.11(EH)
Net-(D2-5): D2.5 D6.5 U11.1(VBUS) U13.7(OUT1)
Net-(D3-4): D3.4 USB1.6(D-)
Net-(D3-6): D3.6 USB1.7(D+)
Net-(D4-4): D4.4 USB2.2(D-)
Net-(D4-6): D4.6 USB2.3(D+)
Net-(D5-4): D5.4 USB2.6(D-)
Net-(D5-6): D5.6 USB2.7(D+)
Net-(D6-1): D6.1 U11.2(D-)
Net-(D6-3): D6.3 U11.3(D+)
Net-(D7-1): D7.1 U12.2(D-)
Net-(D7-2): D7.2 D8.2 U12.4(GND) U12.7(GND_DRAIN) U12.10(EH) U12.11(EH)
Net-(D7-3): D7.3 U12.3(D+)
Net-(D7-5): D7.5 D8.5 U12.1(VBUS) U13.6(OUT2)
Net-(L3-1): L3.1 U9.4(SW)
Net-(L4-1): L4.1 U17.4(SW)
Net-(L5-1): L5.1 USB3.20(GND) USB3.21(GND) USB3.22(GND) USB3.23(GND)
Net-(R1-2): R1.2 U1.3(EN)
Net-(R2-1): R2.1 U1.6(COMP)
Net-(R3-2): R3.2 R4.2 U1.5(FB)
Net-(R5-1): R5.1 U5.6(COMP)
Net-(R6-2): R6.2 U1.4(RT/CLK)
Net-(R7-2): R7.2 U5.4(RT/CLK)
Net-(R8-2): R8.2 U3.1 U5.5(FB)
Net-(R11-2): R11.2 U5.3(EN)
Net-(R18-1): R18.1 U8.1(ISOLATEB)
Net-(R20-2): R20.2 RJ1.L1(LED_G-O+)
Net-(R21-1): R21.1 RJ1.L3(LED_Y-)
Net-(R22-1): R22.1 U8.27(LED1/EESK/SPISC)
Net-(R23-2): R23.2 U8.12(RSET)
Net-(R24-1): R24.1 R25.1 U9.1(FB)
Net-(R26-1): R26.1 U14.8(OC1#)
Net-(R27-1): R27.1 U14.5(OC2#)
Net-(R28-2): R28.2 U14.3(EN1#†) U14.4(EN2#†)
Net-(R29-2): R29.2 U15.3(EN1#†) U15.4(EN2#†)
Net-(R30-1): R30.1 U15.8(OC1#)
Net-(R31-1): R31.1 U15.5(OC2#)
Net-(R32-1): R32.1 U10.1(SMIB)
Net-(R33-1): R33.1 U10.33(RREF)
Net-(R34-1): R34.1 U10.16(SPISO) U16.2(DO(IO1))
Net-(R35-1): R35.1 U10.17(SPICSB) U16.1(CS#)
Net-(R36-1): R36.1 U10.18(SPISCK) U16.6(CLK)
Net-(R37-1): R37.1 U10.19(SPISI) U16.5(DI(IO0))
Net-(R38-1): R38.1 R39.1 U17.1(FB)
Net-(R41-1): R41.1 U16.7(HOLD#(IO3))
Net-(R42-1): R42.1 U16.3(WP#(IO2))

Not connected (* = marked no-connect by the designer): CN1 8(P1)* 9(P2)* 10(P3)* 20(P13)* 21(P14)* 22(P5)*; CN2 8(P1)* 9(P2)* 10(P3)* 20(P13)* 21(P14)* 22(P5)*; U6 6* 8* 9* 10* 11* 12* 13* 14* 15* 16* 17* 18* 19* 20* 21* 22* 23* 32* 34* 36* 38* 40* 42* 44* 46* 48* 50* 54* 56* 58* 59* 60* 61* 62* 64* 65* 66* 67* 68* 70* 71* 73*; U7 6* 8* 10* 12* 14* 16* 18* 20* 22* 24* 26* 28* 30* 32* 34* 36* 38* 40* 42* 44* 46* 48* 56* 58* 67* 68* 69*; U8 3(GPI)* 4(NC)* 5(NC)* 7(NC)* 9(CKXTAL2)* 26(SPICSB)* 31(EECS/SCL)* 32(EEPROM_SEL/PPS_PIN)* 35(LED3)*; U9 6(NC/PG)*; U10 20(OCI4B)* 21(PPON4)* 22(OCI3B)* 23(PPON3)* 52(U3TXDP3)* 53(U3TXDN3)* 55(U3RXDP3)* 56(U3RXDN3)* 58(U2DP3)* 59(U2DM3)* 61(U3TXDP4)* 62(U3TXDN4)* 64(U3RXDP4)* 65(U3RXDN4)* 67(U2DP4)* 68(U2DM4)*; U18 4(LS_OE); U19 1 2 3 4 5 6 7 8 9 10 11 12 13 14 15 16 17 18 19 20 21 22 23 24 25 26 27 28 29 30 31 32 33 34 35 36 37 38 39 40 41 42 43 44 45 46 47 48 49 50 51 52 53 54 55 56 57 58 59 60 61 62 63 64 65 66 67 68 69 70 71 72 73 74 75 76 77 78 79 80 81 82 83 84 85 86 87 88 89 90 91 92 93 94 95 96 97 98 99 100 101 102 103 104 105 106 107 108 109 110 111 112 113 114 115 116 117 118 119 120 121 122 123 124 125 126 127 128 129 130 131 132 133 134 135 136 137 138 139 140 141 142 143 144 145 146 147 148 149 150 151 152 153 154 155 156 157 158 159 160 161 162 163 164 165 166 167 168 169 170 171 172 173 174 175 176 177 178 179 180 181 182 183 184 185 186 187 188 189 190 191 192 193 194 195 196 197 198 199 200 201 202 203 204 205 206 207 208 209 210 211 212 213 214 215 216 217 218 219 220 221 222 223 224 225 226 227 228 229 230 231 232 233 234 235 236 237 238 239 240 241 242 243 244 245 246 247 248 249 250 251 252 253 254 255 256 257 258 259 260 261(EH) 262(EH); USB3 14(Reserved (N.C.))*

## Notes on the sheets
sheet 1
- PWR Source
- PWR Delivery - 5V
- PWR Delivery - 5V
- Decoupling Caps
sheet 3
- M.2 NVMe E-Key Slot
- PWR Stabilizer for Slot
sheet 4
- PWR M.2 E-Key
- M.2 NVMe M-Key Port
sheet 5
- PWR Delivery - 0.9V
- PWR Stabilizer
- Ethernet Controller
- Controller Clock
- Ethernet Port
sheet 6
- Short Prevention Chips (USB 2.0)
- USB 3.2 Controller
- USB 2.0 Ports & TVS Protection
- PWR Delivery - 1.5V
- USB 3.2 Ports and TVS Protection
sheet 7
- HDMI Port
- HDMI Controller Chip
- Sleep Control
